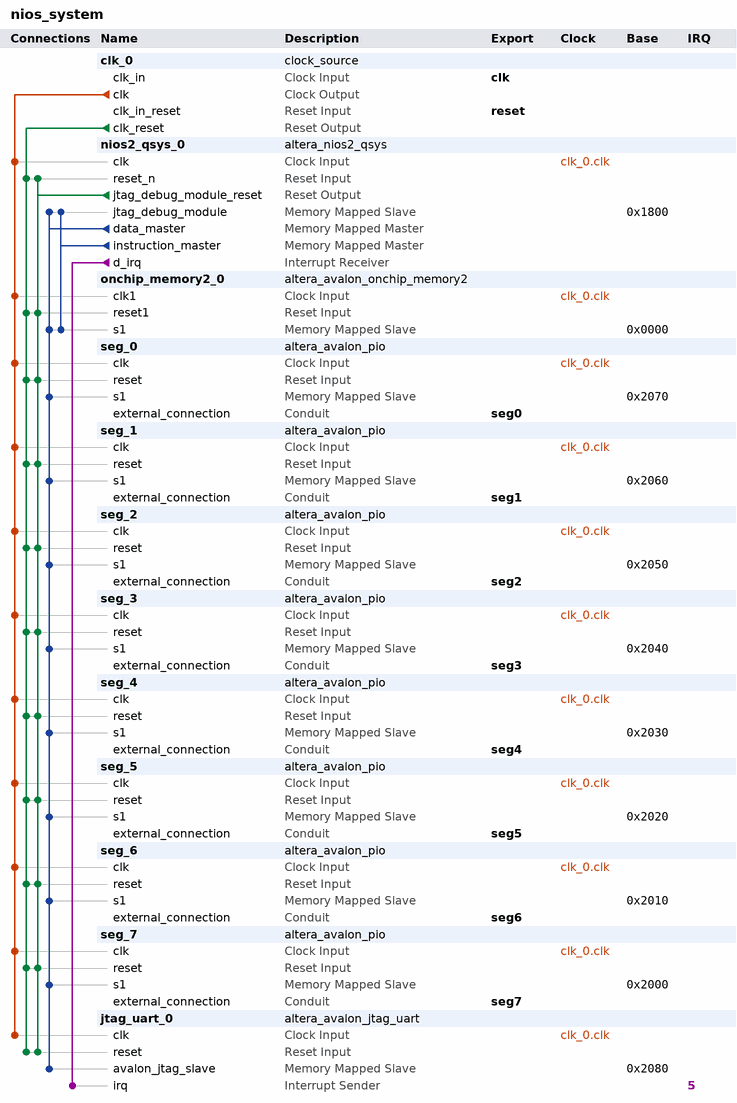
[diagram p0: system contents]
# Platform Designer (Qsys) system nios_system, Cyclone IV E EP4CE115F29C7
# Parameters at their usual value, and those the tool derives, are not listed.
package require -exact qsys 17.1
create_system nios_system
set_project_property DEVICE_FAMILY {Cyclone IV E}
set_project_property DEVICE EP4CE115F29C7

add_instance clk_0 clock_source 17.1
set_instance_parameter_value clk_0 clockFrequency 50000000

add_instance nios2_qsys_0 altera_nios2_qsys 16.1
set_instance_parameter_value nios2_qsys_0 breakSlave nios2_qsys_0.jtag_debug_module
set_instance_parameter_value nios2_qsys_0 exceptionSlave onchip_memory2_0.s1
set_instance_parameter_value nios2_qsys_0 icache_size 4096
set_instance_parameter_value nios2_qsys_0 impl Tiny
set_instance_parameter_value nios2_qsys_0 mmu_TLBMissExcSlave None
set_instance_parameter_value nios2_qsys_0 resetSlave onchip_memory2_0.s1
set_instance_parameter_value nios2_qsys_0 resetrequest_enabled true

add_instance onchip_memory2_0 altera_avalon_onchip_memory2 17.1
set_instance_parameter_value onchip_memory2_0 dataWidth 32
set_instance_parameter_value onchip_memory2_0 dualPort false
set_instance_parameter_value onchip_memory2_0 initMemContent true
set_instance_parameter_value onchip_memory2_0 initializationFileName onchip_mem.hex
set_instance_parameter_value onchip_memory2_0 memorySize 4096

add_instance seg_0 altera_avalon_pio 17.1
set_instance_parameter_value seg_0 direction Output
set_instance_parameter_value seg_0 width 7

add_instance seg_1 altera_avalon_pio 17.1
set_instance_parameter_value seg_1 direction Output
set_instance_parameter_value seg_1 width 7

add_instance seg_2 altera_avalon_pio 17.1
set_instance_parameter_value seg_2 direction Output
set_instance_parameter_value seg_2 width 7

add_instance seg_3 altera_avalon_pio 17.1
set_instance_parameter_value seg_3 direction Output
set_instance_parameter_value seg_3 width 7

add_instance seg_4 altera_avalon_pio 17.1
set_instance_parameter_value seg_4 direction Output
set_instance_parameter_value seg_4 width 7

add_instance seg_5 altera_avalon_pio 17.1
set_instance_parameter_value seg_5 direction Output
set_instance_parameter_value seg_5 width 7

add_instance seg_6 altera_avalon_pio 17.1
set_instance_parameter_value seg_6 direction Output
set_instance_parameter_value seg_6 width 7

add_instance seg_7 altera_avalon_pio 17.1
set_instance_parameter_value seg_7 direction Output
set_instance_parameter_value seg_7 width 7

add_instance jtag_uart_0 altera_avalon_jtag_uart 17.1
set_instance_parameter_value jtag_uart_0 simInteractiveOptions NO_INTERACTIVE_WINDOWS

# connections
add_connection clk_0.clk jtag_uart_0.clk clock
add_connection clk_0.clk nios2_qsys_0.clk clock
add_connection clk_0.clk onchip_memory2_0.clk1 clock
add_connection clk_0.clk seg_0.clk clock
add_connection clk_0.clk seg_1.clk clock
add_connection clk_0.clk seg_2.clk clock
add_connection clk_0.clk seg_3.clk clock
add_connection clk_0.clk seg_4.clk clock
add_connection clk_0.clk seg_5.clk clock
add_connection clk_0.clk seg_6.clk clock
add_connection clk_0.clk seg_7.clk clock
add_connection clk_0.clk_reset jtag_uart_0.reset reset
add_connection clk_0.clk_reset nios2_qsys_0.reset_n reset
add_connection clk_0.clk_reset onchip_memory2_0.reset1 reset
add_connection clk_0.clk_reset seg_0.reset reset
add_connection clk_0.clk_reset seg_1.reset reset
add_connection clk_0.clk_reset seg_2.reset reset
add_connection clk_0.clk_reset seg_3.reset reset
add_connection clk_0.clk_reset seg_4.reset reset
add_connection clk_0.clk_reset seg_5.reset reset
add_connection clk_0.clk_reset seg_6.reset reset
add_connection clk_0.clk_reset seg_7.reset reset
add_connection nios2_qsys_0.jtag_debug_module_reset jtag_uart_0.reset reset
add_connection nios2_qsys_0.jtag_debug_module_reset nios2_qsys_0.reset_n reset
add_connection nios2_qsys_0.jtag_debug_module_reset onchip_memory2_0.reset1 reset
add_connection nios2_qsys_0.jtag_debug_module_reset seg_0.reset reset
add_connection nios2_qsys_0.jtag_debug_module_reset seg_1.reset reset
add_connection nios2_qsys_0.jtag_debug_module_reset seg_2.reset reset
add_connection nios2_qsys_0.jtag_debug_module_reset seg_3.reset reset
add_connection nios2_qsys_0.jtag_debug_module_reset seg_4.reset reset
add_connection nios2_qsys_0.jtag_debug_module_reset seg_5.reset reset
add_connection nios2_qsys_0.jtag_debug_module_reset seg_6.reset reset
add_connection nios2_qsys_0.jtag_debug_module_reset seg_7.reset reset
add_connection nios2_qsys_0.data_master jtag_uart_0.avalon_jtag_slave avalon
set_connection_parameter_value nios2_qsys_0.data_master/jtag_uart_0.avalon_jtag_slave baseAddress 0x2080
add_connection nios2_qsys_0.data_master nios2_qsys_0.jtag_debug_module avalon
set_connection_parameter_value nios2_qsys_0.data_master/nios2_qsys_0.jtag_debug_module baseAddress 0x1800
add_connection nios2_qsys_0.data_master onchip_memory2_0.s1 avalon
set_connection_parameter_value nios2_qsys_0.data_master/onchip_memory2_0.s1 baseAddress 0x0000
add_connection nios2_qsys_0.data_master seg_0.s1 avalon
set_connection_parameter_value nios2_qsys_0.data_master/seg_0.s1 baseAddress 0x2070
add_connection nios2_qsys_0.data_master seg_1.s1 avalon
set_connection_parameter_value nios2_qsys_0.data_master/seg_1.s1 baseAddress 0x2060
add_connection nios2_qsys_0.data_master seg_2.s1 avalon
set_connection_parameter_value nios2_qsys_0.data_master/seg_2.s1 baseAddress 0x2050
add_connection nios2_qsys_0.data_master seg_3.s1 avalon
set_connection_parameter_value nios2_qsys_0.data_master/seg_3.s1 baseAddress 0x2040
add_connection nios2_qsys_0.data_master seg_4.s1 avalon
set_connection_parameter_value nios2_qsys_0.data_master/seg_4.s1 baseAddress 0x2030
add_connection nios2_qsys_0.data_master seg_5.s1 avalon
set_connection_parameter_value nios2_qsys_0.data_master/seg_5.s1 baseAddress 0x2020
add_connection nios2_qsys_0.data_master seg_6.s1 avalon
set_connection_parameter_value nios2_qsys_0.data_master/seg_6.s1 baseAddress 0x2010
add_connection nios2_qsys_0.data_master seg_7.s1 avalon
set_connection_parameter_value nios2_qsys_0.data_master/seg_7.s1 baseAddress 0x2000
add_connection nios2_qsys_0.instruction_master nios2_qsys_0.jtag_debug_module avalon
set_connection_parameter_value nios2_qsys_0.instruction_master/nios2_qsys_0.jtag_debug_module baseAddress 0x1800
add_connection nios2_qsys_0.instruction_master onchip_memory2_0.s1 avalon
set_connection_parameter_value nios2_qsys_0.instruction_master/onchip_memory2_0.s1 baseAddress 0x0000
add_connection nios2_qsys_0.d_irq jtag_uart_0.irq interrupt
set_connection_parameter_value nios2_qsys_0.d_irq/jtag_uart_0.irq irqNumber 5

# exported interfaces
add_interface clk clock sink
set_interface_property clk EXPORT_OF clk_0.clk_in
add_interface reset reset sink
set_interface_property reset EXPORT_OF clk_0.clk_in_reset
add_interface seg0 conduit end
set_interface_property seg0 EXPORT_OF seg_0.external_connection
add_interface seg1 conduit end
set_interface_property seg1 EXPORT_OF seg_1.external_connection
add_interface seg2 conduit end
set_interface_property seg2 EXPORT_OF seg_2.external_connection
add_interface seg3 conduit end
set_interface_property seg3 EXPORT_OF seg_3.external_connection
add_interface seg4 conduit end
set_interface_property seg4 EXPORT_OF seg_4.external_connection
add_interface seg5 conduit end
set_interface_property seg5 EXPORT_OF seg_5.external_connection
add_interface seg6 conduit end
set_interface_property seg6 EXPORT_OF seg_6.external_connection
add_interface seg7 conduit end
set_interface_property seg7 EXPORT_OF seg_7.external_connection

set_interconnect_requirement {$system} qsys_mm.clockCrossingAdapter HANDSHAKE
set_interconnect_requirement {$system} qsys_mm.enableEccProtection FALSE
set_interconnect_requirement {$system} qsys_mm.insertDefaultSlave FALSE
set_interconnect_requirement {$system} qsys_mm.maxAdditionalLatency 1

save_system nios_system.qsys
